# Altium schematic sheet Cockpit Control Node Schematic.SchDoc
size A; SheetNumber: 1; SheetTotal: 1
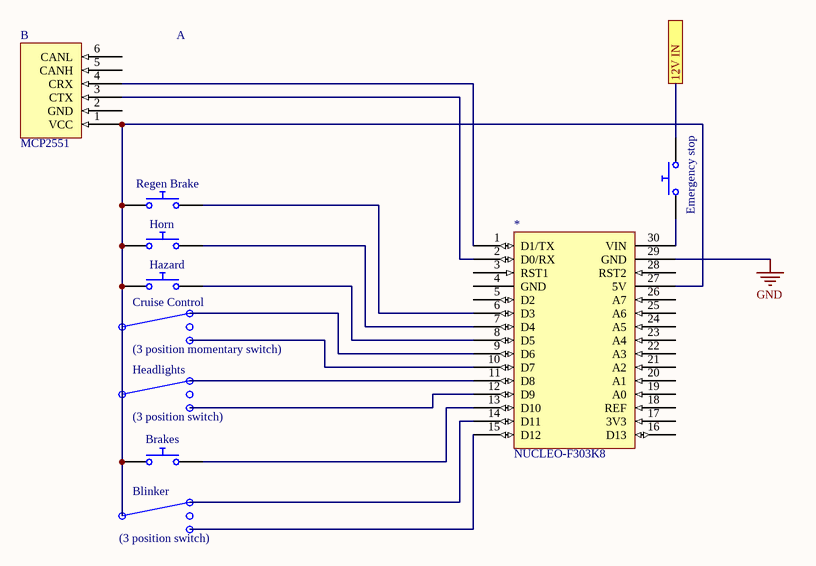
[diagram p0: Cockpit Control Node Schematic.SchDoc]

## Parts
(Parts that share a designator on the sheet are numbered #1, #2 ... from top to bottom, then left to right.)
*  NUCLEO-F303K8  [NUCLEO-F303K8-Footprint-1]
?#1  (no value)  [MCP2551-Footprint-1]  (part A of 2)
?#2  MCP2551  [MCP2551-Footprint-1]  (part B of 2)
Blinker  (3 position switch)
Brakes  Push Button Normally Opened  (value not drawn)
Cruise_Control  (3 position momentary switch)
Emergency_stop  Push Button Normally Opened  (value not drawn)
Hazard  Push Button Normally Opened  (value not drawn)
Headlights  (3 position switch)
Horn  Push Button Normally Opened  (value not drawn)
Regen_Brake  Push Button Normally Opened  (value not drawn)

## Ports
12V IN

## Nets
GND: *.29(GND)
12V IN: Emergency_stop.2 ; port 12V IN
Net*_1: *.1(D1/TX) ?#2.4(CRX)
Net*_2: *.2(D0/RX) ?#2.3(CTX)
Net*_6: *.6(D3) Regen_Brake.2
Net*_7: *.7(D4) Horn.2
Net*_8: *.8(D5) Hazard.2
Net*_13: *.13(D10) Brakes.2
Net*_27: *.27(5V) ?#2.1(VCC) Brakes.1 Hazard.1 Horn.1 Regen_Brake.1
Net*_30: *.30(VIN) Emergency_stop.1

Not connected (* = marked no-connect by the designer): * 3(RST1) 4(GND) 5(D2) 9(D6) 10(D7) 11(D8) 12(D9) 14(D11) 15(D12) 16(D13) 17(3V3) 18(REF) 19(A0) 20(A1) 21(A2) 22(A3) 23(A4) 24(A5) 25(A6) 26(A7) 28(RST2); ?#2 2(GND) 5(CANH) 6(CANL)

## Library data of the parts
* = nucleof303k8-1: Boards/Accessories
?#1 ?#2 = MCP2551-1
Blinker Cruise_Control Headlights = CMP-3PosMomSwitch-2: 3 way switch with middle being null
Brakes Emergency_stop Hazard Horn Regen_Brake = Push Button NO: closed: 0; Rclosed: 1m; Ropen: 1Meg; SimulationGenericComponent: True